# Altium schematic sheet Stepper Motor2.SchDoc
size A2; SheetNumber: 5; SheetTotal: 7
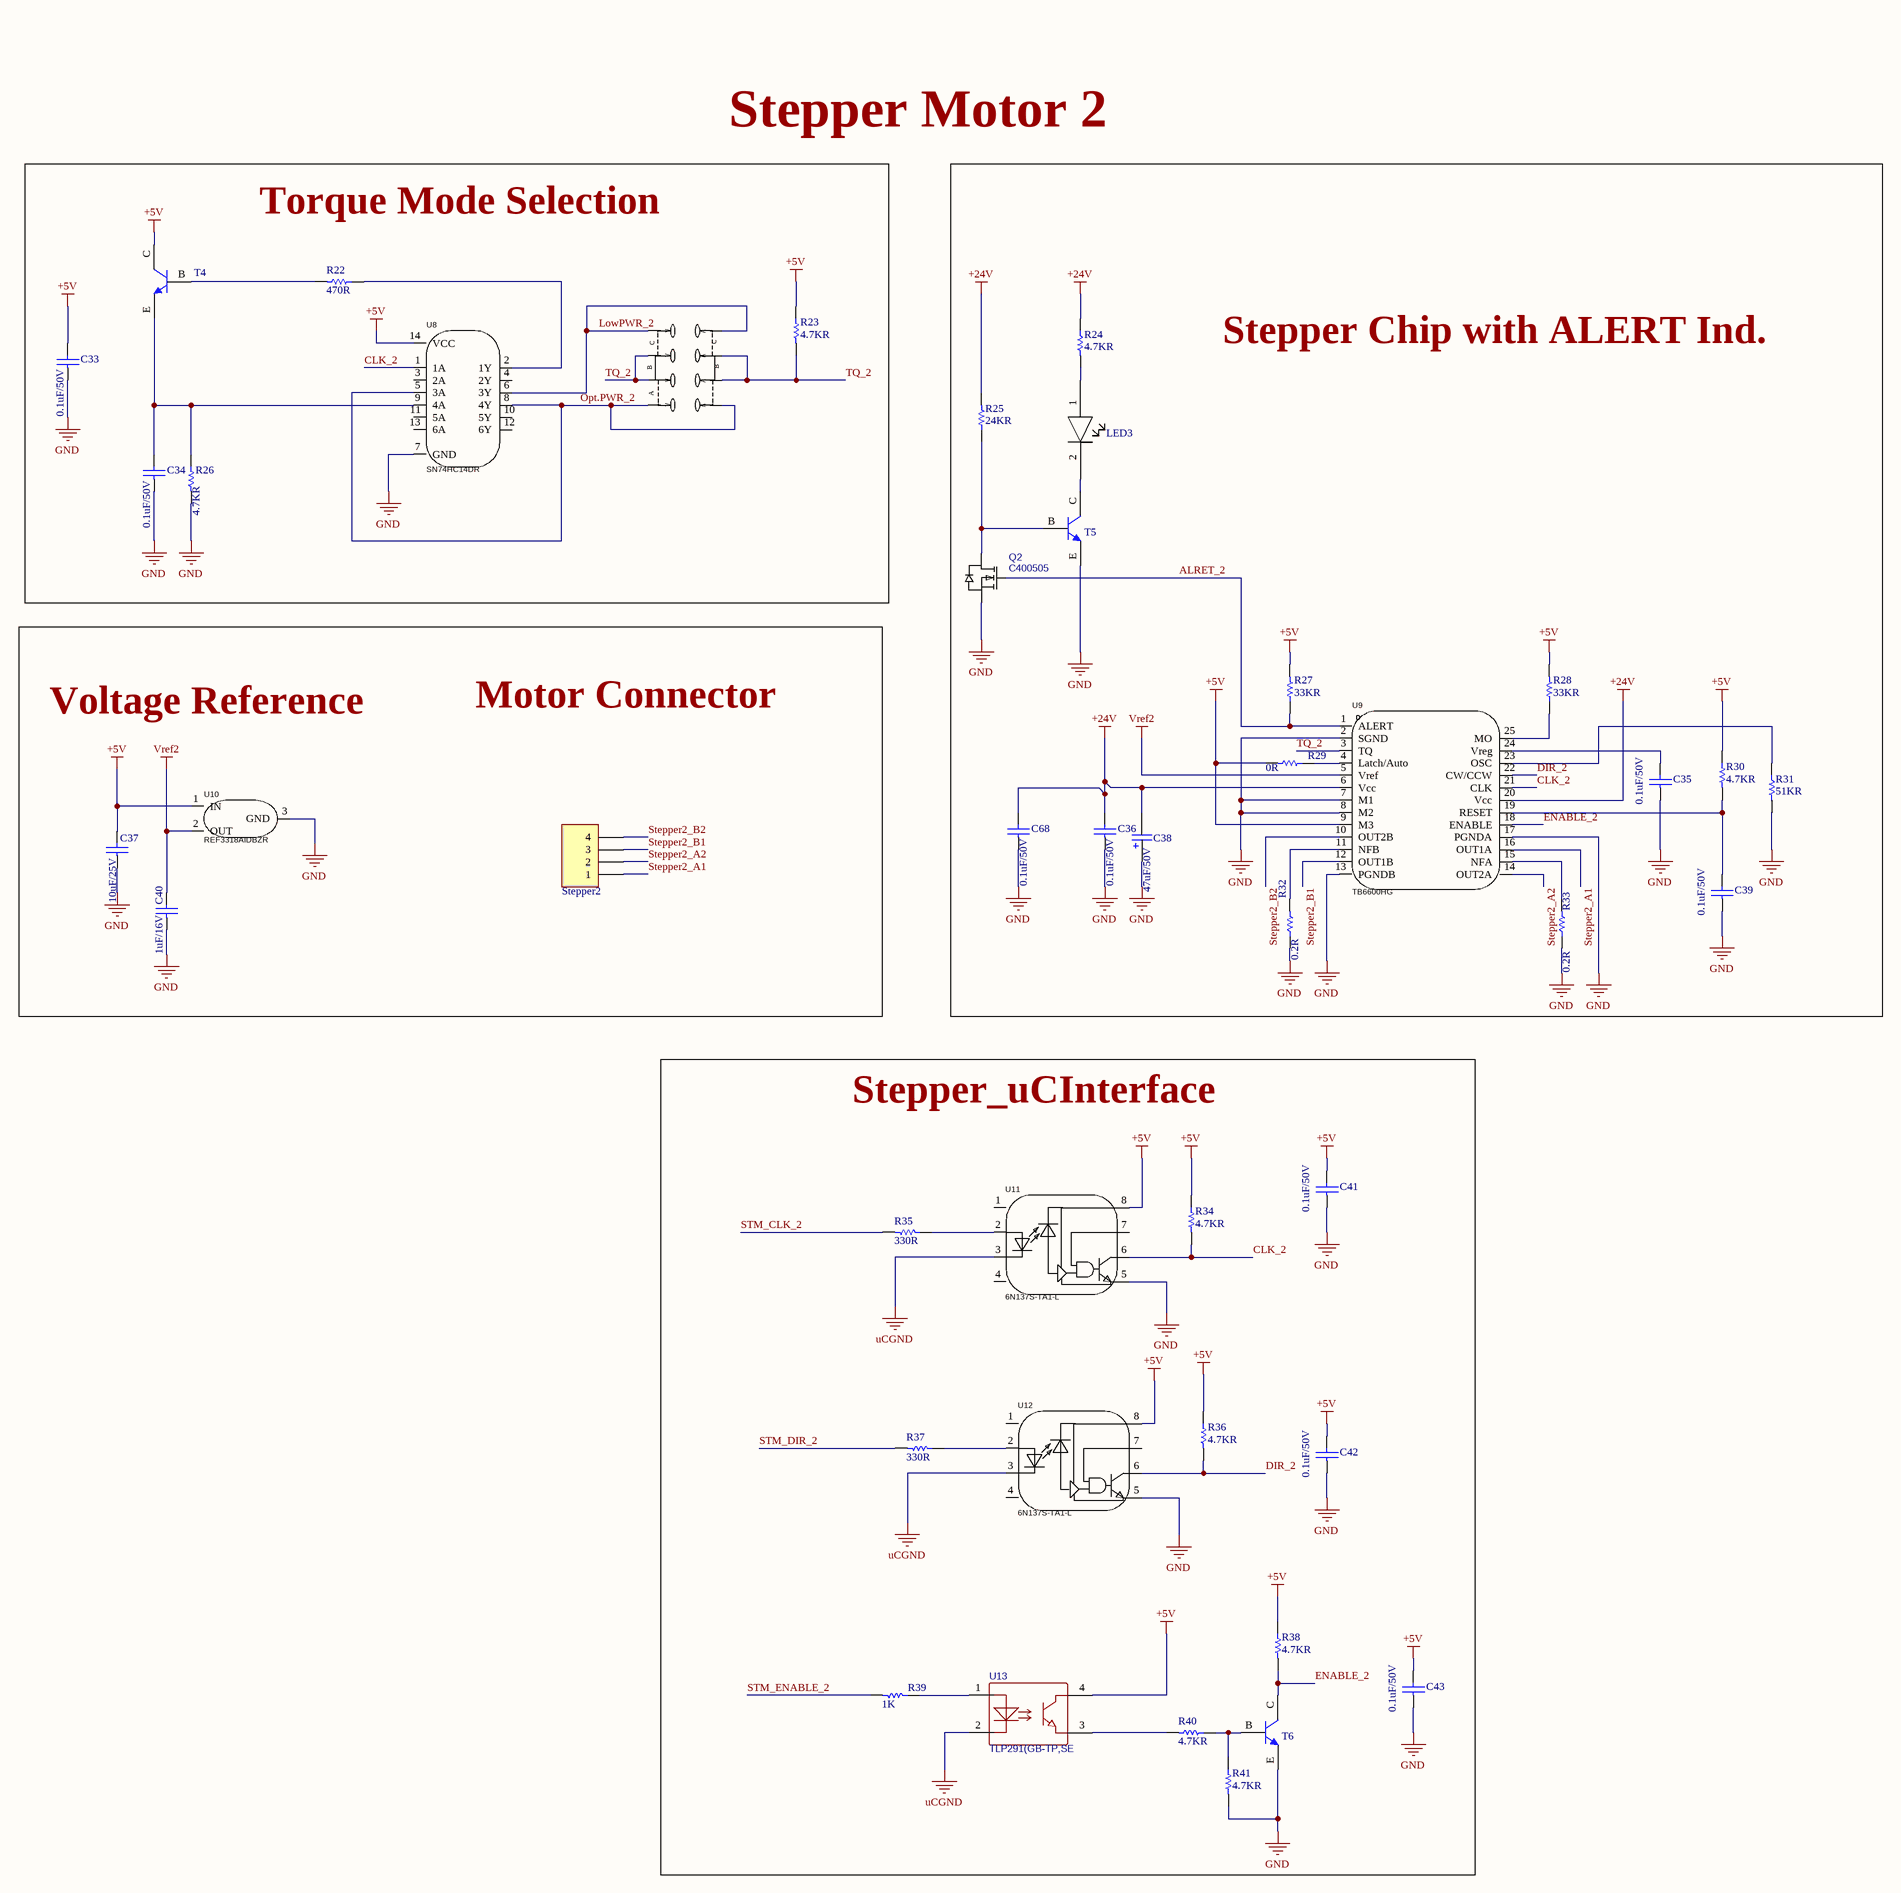
[diagram p0: Stepper Motor2.SchDoc]

## Parts
C33  0.1uF/50V  [PCBComponent_1]
C34  0.1uF/50V  [PCBComponent_1]
C35  0.1uF/50V  [PCBComponent_1]
C36  0.1uF/50V  [PCBComponent_1]
C37  10uF/25V  [PCBComponent_1]
C38  47uF/50V  [CAPLEAD_D6.3mm]  (no BOM)
C39  0.1uF/50V  [PCBComponent_1]
C40  1uF/16V  [PCBComponent_1]
C41  0.1uF/50V  [PCBComponent_1]
C42  0.1uF/50V  [PCBComponent_1]
C43  0.1uF/50V  [PCBComponent_1]
C68  0.1uF/50V  [PCBComponent_1]
LED3  1206 LED  [1206 LED]  (value not drawn)
Q2  C400505  [SOT-23-3_L2.9-W1.3-P1.90-LS2.4-BR]
R22  470R  [RESC1608X06N]
R23  4.7KR  [R0402]
R24  4.7KR  [R0402]
R25  24KR  [RESC1608X06N]
R26  4.7KR  [R0402]
R27  33KR  [RESC1608X06N]
R28  33KR  [RESC1608X06N]
R29  0R  [RESC1608X06N]
R30  4.7KR  [R0402]
R31  51KR  [R0402]
R32  0.2R  [RESC6431X12N]
R33  0.2R  [RESC6431X12N]
R34  4.7KR  [R0402]
R35  330R  [R0402]
R36  4.7KR  [R0402]
R37  330R  [R0402]
R38  4.7KR  [R0402]
R39  1K  [R0402]
R40  4.7KR  [R0402]
R41  4.7KR  [R0402]
Stepper2  Header 4 Pin Polar  [PCBComponent_1]  (value not drawn)  (no BOM)
SW2  MST23D19G2  [SW-SMD_MST23D19G2]  (value not drawn)
T4  MMBT3904 Transistor  [MMBT3904]  (value not drawn)
T5  MMBT3904 Transistor  [MMBT3904]  (value not drawn)
T6  MMBT3904 Transistor  [MMBT3904]  (value not drawn)
U8  SN74HC14DR  [SOIC-14_L8.7-W3.9-P1.27-LS6.0-BL]
U9  TB6600HG  [HZIP25-P-1.00F]  (no BOM)
U10  REF3318AIDBZR  [SOT-23-3_L2.9-W1.3-P1.90-LS2.4-BR]
U11  6N137S-TA1-L  [SOP-8_L9.8-W6.6-P2.54-LS10.3-BL]
U12  6N137S-TA1-L  [SOP-8_L9.8-W6.6-P2.54-LS10.3-BL]
U13  TLP291(GB-TP,SE  [SOP-4-1.27mm]

## Blocks framed on the sheet
Torque Mode Selection: C33 C34 R22 R23 R26 SW2 T4 U8
Stepper Chip with ALERT Ind.: C35 C36 C38 C39 C68 LED3 Q2 R24 R25 R27-R33 T5 U9
Stepper_uCInterface: C41-C43 R34-R41 T6 U11-U13

## Nets
+5V: C33.2 C37.2 C41.2 C42.2 C43.2 R23.1 R27.2 R28.2 R29.2 R30.1 R34.1 R36.1 R38.1 T4.C U8.14(VCC) U9.9(M3) U10.1(IN) U11.8 U12.8 U13.4
+24V: C36.2 C38.2 C68.2 R24.1 R25.2 U9.6(Vcc) U9.20(Vcc)
GND: C33.1 C34.1 C35.1 C36.1 C37.1 C38.1 C39.1 C40.1 C41.1 C42.1 C43.1 C68.1 Q2.2(S) R26.2 R31.2 R32.1 R33.1 R41.2 T5.E T6.E U8.7(GND) U9.2(SGND) U9.7(M1) U9.8(M2) U9.13(PGNDB) U9.17(PGNDA) U10.3(GND) U11.5 U12.5
uCGND: U11.3 U12.3 U13.2
Vref2: C40.2 U9.5(Vref) U10.2(OUT)
ALRET_2: Q2.1(G) R27.1 U9.1(ALERT)
CLK_2: R34.2 U8.1(1A) U9.21(CLK) U11.6
DIR_2: R36.2 U9.22(CW/CCW) U12.6
ENABLE_2: R38.2 T6.C U9.18(ENABLE)
LowPWR_2: SW2.4 SW2.5 U8.6(3Y)
Opt.PWR_2: SW2.1 SW2.8 U8.5(3A) U8.8(4Y)
Stepper2_A1: Stepper2.1 U9.16(OUT1A)
Stepper2_A2: Stepper2.2 U9.14(OUT2A)
Stepper2_B1: Stepper2.3 U9.12(OUT1B)
Stepper2_B2: Stepper2.4 U9.10(OUT2B)
STM_CLK_2: R35.2
STM_DIR_2: R37.2
STM_ENABLE_2: R39.2
TQ_2: R23.2 SW2.2 SW2.3 SW2.6 SW2.7 U9.3(TQ)
NetC34_2: C34.2 R26.1 T4.E U8.9(4A)
NetC35_2: C35.2 U9.24(Vreg)
NetC39_2: C39.2 R30.2 U9.19(RESET)
NetLED3_1: LED3.1 R24.2
NetLED3_2: LED3.2 T5.C
NetQ2_3: Q2.3(D) R25.1 T5.B
NetR22_1: R22.1 U8.2(1Y)
NetR22_2: R22.2 T4.B
NetR28_1: R28.1 U9.25(MO)
NetR29_1: R29.1 U9.4(Latch/Auto)
NetR31_1: R31.1 U9.23(OSC)
NetR32_2: R32.2 U9.11(NFB)
NetR33_2: R33.2 U9.15(NFA)
NetR35_1: R35.1 U11.2
NetR37_1: R37.1 U12.2
NetR39_1: R39.1 U13.1
NetR40_1: R40.1 R41.1 T6.B
NetR40_2: R40.2 U13.3

Not connected (* = marked no-connect by the designer): U8 3(2A) 4(2Y) 10(5Y) 11(5A) 12(6Y) 13(6A); U11 1(NC) 4(NC) 7; U12 1(NC) 4(NC) 7

## Notes on the sheet
- Stepper Motor 2
- Voltage Reference
- Motor Connector
- (in symbol MST23D19G2) C; B; A

## Library data of the parts
C33-C36 C39 C41-C43 C68 = 0603 Capacitor: C1591; Created By: NourAldin; DataSheet Link: https://eu.mouser.com/datasheet/2/400/lcc_automotive_general_en-843974.pdf; Mouser Link: https://eu.mouser.com/ProductDetail/TDK/CGA1A2X7R1H331M030BA?qs=sGAEpiMZZMs0AnBnWHyRQL8L3bkL%252bvtyS9XpSB1mk7rVV5K8%252bbxEeg%3d%3d
C37 = 0603 Capacitor: C96446; Created By: NourAldin; DataSheet Link: https://eu.mouser.com/datasheet/2/400/lcc_automotive_general_en-843974.pdf; Mouser Link: https://eu.mouser.com/ProductDetail/TDK/CGA1A2X7R1H331M030BA?qs=sGAEpiMZZMs0AnBnWHyRQL8L3bkL%252bvtyS9XpSB1mk7rVV5K8%252bbxEeg%3d%3d
C38 = A759EQ475M2AAAE160: C45100; Manufacturer: KEMET; Supplier 1: Mouser; Manufacturer Part Number: A759EQ475M2AAAE160; RoHS: Yes; Category: Polymer Capacitors; Stock 1: 17219; Pricing 1: 1=0.97, 10=0.73, 50=0.73, 100=0.546, 1000=0.384, 10000=0.326 (USD); ComponentLink1URL: http://www.kemet.com/docfinder?Partnumber=A759EQ475M2AAAE160&src-supplier=Digikey; ComponentLink1Description: http://www.kemet.com/docfinder?Partnumber=A759EQ475M2AAAE160&src-supplier=Digikey; ComponentLink2URL: http://www.farnell.com/datasheets/2095614.pdf?src-supplier=Element14; ComponentLink2Description: http://www.farnell.com/datasheets/2095614.pdf?src-supplier=Element14; Supplier Part Number 1: 80-A759EQ475M2AAE160
C40 = 0603 Capacitor: C1592; Created By: NourAldin; DataSheet Link: https://eu.mouser.com/datasheet/2/400/lcc_automotive_general_en-843974.pdf; Mouser Link: https://eu.mouser.com/ProductDetail/TDK/CGA1A2X7R1H331M030BA?qs=sGAEpiMZZMs0AnBnWHyRQL8L3bkL%252bvtyS9XpSB1mk7rVV5K8%252bbxEeg%3d%3d
LED3 = 1206 LED: C434438; Created By: NourAldin
Q2 = BSS138_MOSFET: Manufacturer: YANGJIE(扬杰); Manufacturer Part: BSS138; Contributor: LCSC; Supplier: LCSC; Supplier Part: C400505; JLCPCB Part Class: Extended Part; spicePre: Q; spiceSymbolName: BSS138_C400505
R22 = 0603 Resistor: C114669; Created By: NourAldin; Mouser Link: https://eu.mouser.com/ProductDetail/Panasonic/ERA-3AHD180V?qs=sGAEpiMZZMvdGkrng054t5mej2KPdPuFSlDBd1tSiF0%3d; DataSheet Link: https://eu.mouser.com/datasheet/2/315/AOA0000C307-1149632.pdf
R23 R24 R26 R30 R34 R36 R38 R40 R41 = 0402 Resistor: C105871
R25 = 0603 Resistor: C2930081; Created By: NourAldin; Mouser Link: https://eu.mouser.com/ProductDetail/Panasonic/ERA-3AHD180V?qs=sGAEpiMZZMvdGkrng054t5mej2KPdPuFSlDBd1tSiF0%3d; DataSheet Link: https://eu.mouser.com/datasheet/2/315/AOA0000C307-1149632.pdf
R27 R28 = 0603 Resistor: C126359; Created By: NourAldin; Mouser Link: https://eu.mouser.com/ProductDetail/Panasonic/ERA-3AHD180V?qs=sGAEpiMZZMvdGkrng054t5mej2KPdPuFSlDBd1tSiF0%3d; DataSheet Link: https://eu.mouser.com/datasheet/2/315/AOA0000C307-1149632.pdf
R29 = 0603 Resistor: C100044; Created By: NourAldin; Mouser Link: https://eu.mouser.com/ProductDetail/Panasonic/ERA-3AHD180V?qs=sGAEpiMZZMvdGkrng054t5mej2KPdPuFSlDBd1tSiF0%3d; DataSheet Link: https://eu.mouser.com/datasheet/2/315/AOA0000C307-1149632.pdf
R31 = 0402 Resistor: C107230
R32 R33 = 2512 Resistor: C2903473; Created By: NourAldin; Mouser Link: https://eu.mouser.com/ProductDetail/Bourns/CSS2H-2512K-2L00F?qs=sGAEpiMZZMukHu%252bjC5l7YewuupLM8jZrvWs15Y6t0rY%3D&fbclid=IwAR0ZD_uc1Y03YG_KyYG8NxrpBzYgFzVeevvjxrlqtGWJ1HKz-jrYfqlFWCw; DataSheet Link: https://eu.mouser.com/datasheet/2/54/ss2h-2512-1302652.pdf
R35 R37 = 0402 Resistor: C105875
R39 = 0402 Resistor: C106235
SW2 = MST23D19G2: C431545; Manufacturer: SHOU HAN(首韩); Add into BOM: yes; Circuit: 双刀三掷; Pin Style: SMDSplicing; Switch Length: 12.95mm; Switch Width: 3.55mm; Switch Height: 3.5mm; Current Rating (DC): 100mA; Voltage Rating (DC): 12V; Mechanical Life: 1万次; Symbol: MST23D19G2; Device: MST23D19G2; LCSC Part Name: 三档立式贴片 8脚拨动 柄长2.0MM; Supplier Part: C431545; Manufacturer Part: MST23D19G2; Supplier Footprint: SMD; JLCPCB Part Class: Extended Part; Datasheet: https://atta.szlcsc.com/upload/public/pdf/source/20190925/C431545_A88710AC241B275593C257CF6D595AD7.pdf; Supplier: LCSC; Convert to PCB: yes; Actuator Style: -; Mounting Style: Brick nogging; Actuator Color: -; Current Rating (AC): -; Voltage Rating (AC): -; Operating Temperature: -25℃~+70℃
T4-T6 = MMBT3904 Transistor: C108429; Created By: NourAldin
U8 = SN74HC14DR: C6820; Manufacturer: TI(德州仪器); Add into BOM: yes; Input Type: Schmitt Trigger; Supply Voltage(Single): 2V~6V; Supply Current (Max): 2uA; Number of Circuits: 6; Number of Inputs: 1; Sink Current: 5.2mA; High level range (VIH): 1.5V~4.2V; Low level range (VIL): 300mV~1.2V; Max Propagation Delay: 21ns@6V,50pF; Symbol: SN74HC14DR; Device: SN74HC14DR; LCSC Part Name: 六路施密特触发反相器; Supplier Part: C6820; Manufacturer Part: SN74HC14DR; Supplier Footprint: SOIC-14; JLCPCB Part Class: Extended Part; Datasheet: https://www.ti.com/cn/lit/gpn/sn74hc14; Supplier: LCSC; Convert to PCB: yes; Source Current: 5.2mA; Series: 74HCSeries; Operating Temperature: -40℃~+85℃
U9 = TB6600HG: C66042; Manufacturer: TOSHIBA(东芝); Add into BOM: yes; Symbol: TB6600HG; Device: TB6600HG; LCSC Part Name: 4.5A 42V电机驱动芯片; Supplier Part: C66042; Manufacturer Part: TB6600HG; Supplier Footprint: HZIP-25-P-1mm; JLCPCB Part Class: Extended Part; Datasheet: https://atta.szlcsc.com/upload/public/pdf/source/20170511/1494500127812.pdf; Supplier: LCSC; Convert to PCB: yes
U10 = REF3318AIDBZR: C115877; Manufacturer: TI(德州仪器); Add into BOM: yes; Output Type: Fixed; Input Voltage: 2V~5.5V; Output Voltage: 1.8V; Output Current: 5mA; Tolerance: ±0.15%; Temperature Coefficient: 30ppm/℃; Reference Type: series connection; Supply Current: 8.5uA; Noise - 1/10Hz to 10Hz: 50uVp-p; Symbol: REF3318AIDBZR; Device: REF3318AIDBZR; LCSC Part Name: REF3318AIDBZR; Supplier Part: C115877; Manufacturer Part: REF3318AIDBZR; Supplier Footprint: SOT-23; JLCPCB Part Class: Extended Part; Datasheet: https://www.ti.com/cn/lit/gpn/ref3318; Supplier: LCSC; Convert to PCB: yes; Noise - 10Hz to 10kHz: -; Operating Temperature: -40℃~+125℃@(Ta)
U11 U12 = 6N137S-TA1-L: C92651; Manufacturer: LITEON(光宝); Add into BOM: yes; Input Type: DC; Supply Voltage: 4.5V~5.5V; Common Mode Transient Immunity (CMTI): 10kV/us; Data Rate: 15Mbit/s; Propagation Delay tpLH/tpHL: 32ns；40ns; Number of Channels: 1; Symbol: 6N137S-TA1; Device: 6N137S-TA1-L; LCSC Part Name: DC输入 1通道; Supplier Part: C92651; Manufacturer Part: 6N137S-TA1-L; Supplier Footprint: SOP-8-2.54mm; JLCPCB Part Class: Extended Part; Datasheet: https://atta.szlcsc.com/upload/public/pdf/source/20191018/C92651_D1F9F6F1F10C7EC7C3739E5ECB700036.pdf; Supplier: LCSC; Convert to PCB: yes; Operating Temperature: -40℃~+85℃
U13 = TLP291(GB-TP,SE(T: C55144; BOM_Manufacturer: TOSHIBA(东芝); BOM_Supplier: LCSC; Manufacturer Part Number: TLP291(GB-TP,SE; Supplier Part Number 2: C55144; BOM_JLCPCB Part Class: Extended Part; LCSC Link: https://www.lcsc.com/product-detail/Optocouplers-Phototransistor-Output_TOSHIBA-TLP291-GB-TP-SE_C55144.html; spiceSymbolName: TLP291(GB-TP,SE(T